# Altium schematic sheet Firing channels.SchDoc
size 381 x 241 mm; SheetNumber: 2; SheetTotal: 6
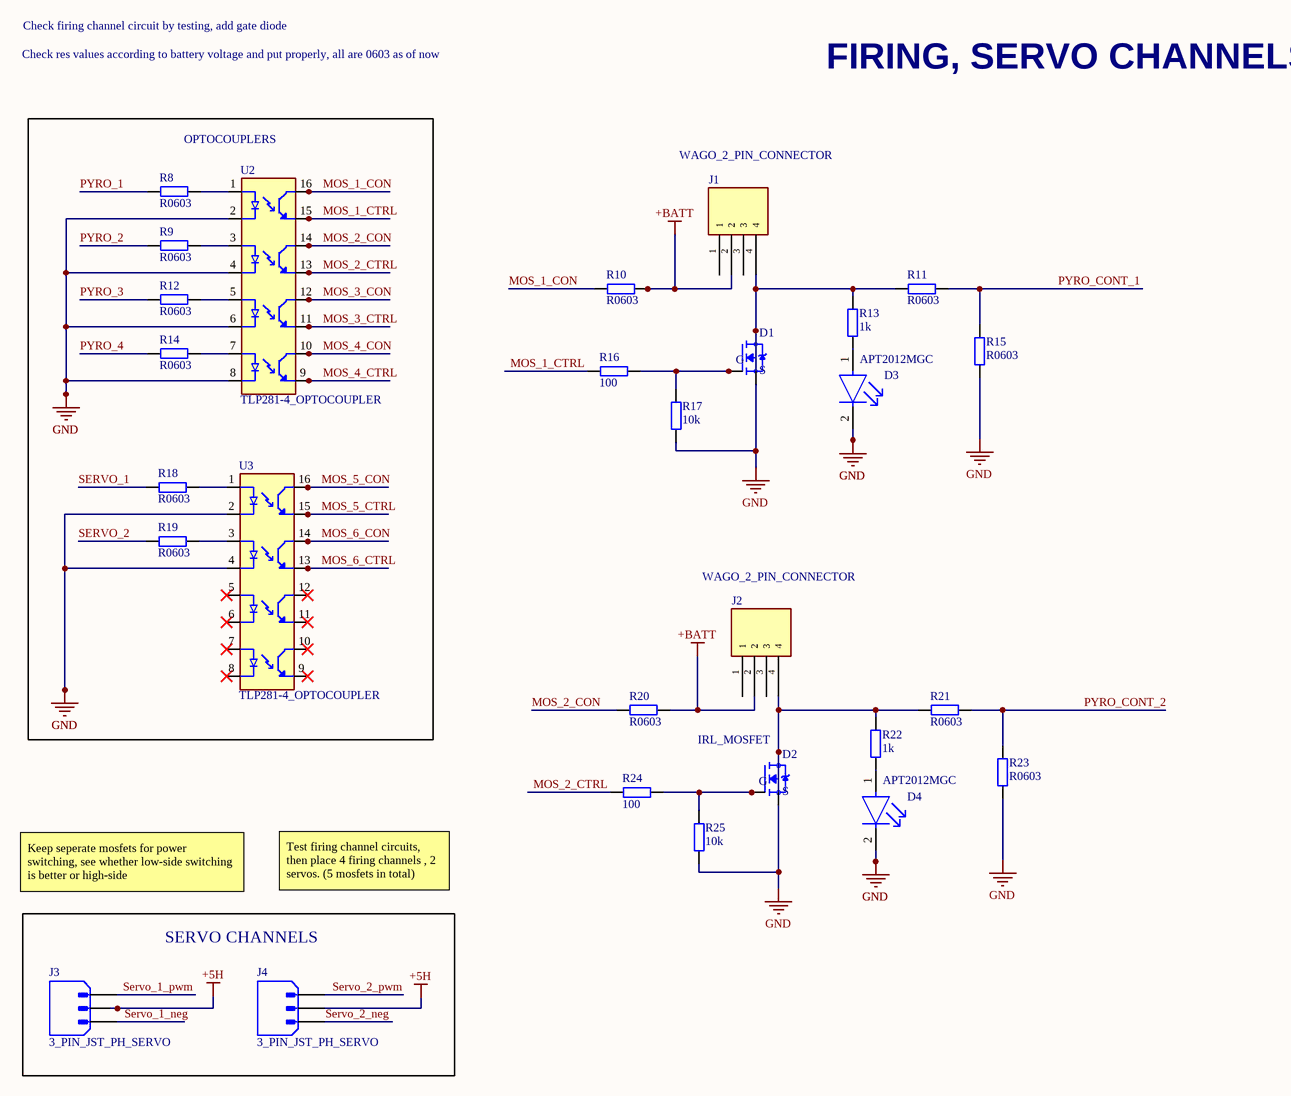
[diagram p0: Firing channels.SchDoc]

## Parts
1  (no value)  [IRLR7843]
2  IRL_MOSFET  [IRLR7843]
D3  APT2012MGC  [FP-APT2012MGC-MFG]
D4  APT2012MGC  [FP-APT2012MGC-MFG]
J1  WAGO_2_PIN_CONNECTOR  [WAGO_CONNECTOR]
J2  WAGO_2_PIN_CONNECTOR  [WAGO_CONNECTOR]
J3  3_PIN_JST_PH_SERVO  [3_PIN_JST_PH_SERVO]
J4  3_PIN_JST_PH_SERVO  [3_PIN_JST_PH_SERVO]
R8  R0603  [RES_0603]
R9  R0603  [RES_0603]
R10  R0603  [RES_0603]
R11  R0603  [RES_0603]
R12  R0603  [RES_0603]
R13  1k  [RES_0603]
R14  R0603  [RES_0603]
R15  R0603  [RES_0603]
R16  100  [RES_0603]
R17  10k  [RES_0603]
R18  R0603  [RES_0603]
R19  R0603  [RES_0603]
R20  R0603  [RES_0603]
R21  R0603  [RES_0603]
R22  1k  [RES_0603]
R23  R0603  [RES_0603]
R24  100  [RES_0603]
R25  10k  [RES_0603]
U2  TLP281-4_OPTOCOUPLER  [TLP281-4_OPTOCOUPLER]
U3  TLP281-4_OPTOCOUPLER  [TLP281-4_OPTOCOUPLER]

## Blocks framed on the sheet
OPTOCOUPLERS: R8 R9 R12 R14 R18 R19 U2 U3
SERVO CHANNELS: J3 J4

## Nets
+5H: J3.2 J4.2
+BATT: J1.2 J2.2 R10.2 R20.2
GND: 1.2(S) 2.2(S) D3.2(C) D4.2(C) R15.1 R17.1 R23.1 R25.1 U2.2(C1) U2.4(C2) U2.6(C3) U2.8(C4) U3.2(C1) U3.4(C2)
MOS_1_CON: R10.1 U2.16(CT1)
MOS_1_CTRL: R16.1 U2.15(ET1)
MOS_2_CON: R20.1 U2.14(CT2)
MOS_2_CTRL: R24.1 U2.13(ET2)
MOS_3_CON: U2.12(CT3)
MOS_3_CTRL: U2.11(ET3)
MOS_4_CON: U2.10(CT4)
MOS_4_CTRL: U2.9(ET4)
MOS_5_CON: U3.16(CT1)
MOS_5_CTRL: U3.15(ET1)
MOS_6_CON: U3.14(CT2)
MOS_6_CTRL: U3.13(ET2)
PYRO_1: R8.1
PYRO_2: R9.1
PYRO_3: R12.1
PYRO_4: R14.1
PYRO_CONT_1: R11.2 R15.2
PYRO_CONT_2: R21.2 R23.2
SERVO_1: R18.1
Servo_1_neg: J3.1
Servo_1_pwm: J3.3
SERVO_2: R19.1
Servo_2_neg: J4.1
Servo_2_pwm: J4.3
Net1_1: 1.1(G) R16.2 R17.2
Net1_3: 1.3(D) J1.4 R11.1 R13.2
Net2_1: 2.1(G) R24.2 R25.2
Net2_3: 2.3(D) J2.4 R21.1 R22.2
NetD3_1: D3.1(A) R13.1
NetD4_1: D4.1(A) R22.1
NetR8_2: R8.2 U2.1(A1)
NetR9_2: R9.2 U2.3(A2)
NetR12_2: R12.2 U2.5(A3)
NetR14_2: R14.2 U2.7(A4)
NetR18_2: R18.2 U3.1(A1)
NetR19_2: R19.2 U3.3(A2)

Not connected (* = marked no-connect by the designer): J1 1 3; J2 1 3; U3 5(A3)* 6(C3)* 7(A4)* 8(C4)* 9(ET4)* 10(CT4)* 11(ET3)* 12(CT3)*

## Notes on the sheet
- Check firing channel circuit by testing, add gate diode
- Check res values according to battery voltage and put properly, all are 0603 as of now
- FIRING, SERVO CHANNELS
- Keep seperate mosfets for power switching, see whether low-side switching is better or high-side
- Test firing channel circuits, then place 4 firing channels , 2 servos. (5 mosfets in total)

## Library data of the parts
1 = IRL_MOSFET
D3 D4 = CMP-44529-000017-1: LED GREEN CLEAR CHIP SMD; Power Rating: 75mW; Lens Color: Colorless; Luminous Intensity: 70mcd; Forward Current: 20mA; Dominant Wavelength: 570nm; Viewing Angle: 120°; Forward Voltage: 2.1V; Package Quantity: 2000; Color: Green; Length: 2mm; Lead Free: Lead Free; Min Operating Temperature: -40°C; Illumination Color: Green; Case/Package: 0805; Width: 1.25mm; Test Current: 20mA; Max Operating Temperature: 85°C; Case Code (Imperial): 0805; Mount: Surface Mount; Lens Style: Clear; Height: 0.75mm; Case Code (Metric): 2012; Packaging: Tape and Reel; Lens Transparency: Clear
R8-R25 = RES_0603: Resistor SMD 0603; Manufacturer: *; Manufacturer Part Number: *; Distributor Link: *; LCSC: *